# Altium schematic sheet SD.SchDoc
size A4; SheetNumber: 9; SheetTotal: 17
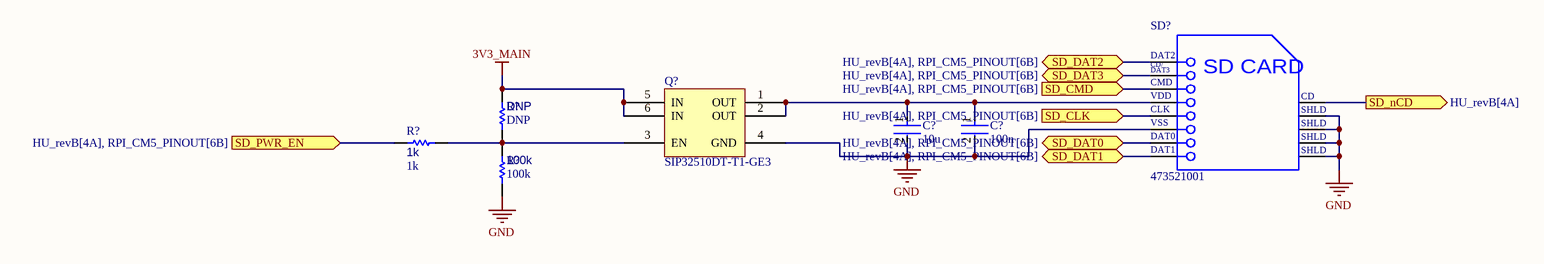
[diagram p0: SD.SchDoc]

## Parts
(Parts that share a designator on the sheet are numbered #1, #2 ... from top to bottom, then left to right.)
C?#1  10u  [FP-0402-L_1_0_0_05-W_0_5-IPC_A]
C?#2  100n  [FP-0402-L_1_0_0_05-W_0_5-IPC_A]
Q?  SIP32510DT-T1-GE3  [SOT95P284X110-6N]
R?#1  DNP  [R0603B]
R?#2  1k  [R0603B]
R?#3  100k  [R0603B]
SD?  473521001  [MOLX-473521001_V]

## Ports
SD_CLK (in, see HU_revB[4A], RPI_CM5_PINOUT[6B]), SD_CMD (in, see HU_revB[4A], RPI_CM5_PINOUT[6B]), SD_DAT0 (bidir, see HU_revB[4A], RPI_CM5_PINOUT[6B]), SD_DAT1 (bidir, see HU_revB[4A], RPI_CM5_PINOUT[6B]), SD_DAT2 (bidir, see HU_revB[4A], RPI_CM5_PINOUT[6B]), SD_DAT3 (bidir, see HU_revB[4A], RPI_CM5_PINOUT[6B]), SD_nCD (out, see HU_revB[4A]), SD_PWR_EN (in, see HU_revB[4A], RPI_CM5_PINOUT[6B])

## Nets
3V3_MAIN: Q?.5(IN) Q?.6(IN) R?#1.2
GND: C?#1.2 C?#2.2 Q?.4(GND) R?#3.1 SD?.6(VSS) SD?.10(SHLD) SD?.11(SHLD) SD?.12(SHLD) SD?.13(SHLD)
SD_CLK: SD?.5(CLK) ; port SD_CLK
SD_CMD: SD?.3(CMD) ; port SD_CMD
SD_DAT0: SD?.7(DAT0) ; port SD_DAT0
SD_DAT1: SD?.8(DAT1) ; port SD_DAT1
SD_DAT2: SD?.1(DAT2) ; port SD_DAT2
SD_DAT3: SD?.2(CD/DAT3) ; port SD_DAT3
SD_nCD: SD?.9(CD) ; port SD_nCD
SD_PWR_EN: R?#2.2 ; port SD_PWR_EN
NetC?#1_1: C?#1.1 C?#2.1 Q?.1(OUT) Q?.2(OUT) SD?.4(VDD)
NetQ?_3: Q?.3(EN) R?#1.1 R?#2.1 R?#3.2

## Notes on the sheet
- (in symbol CMP-2000-05848-1) CD/; DAT3; SD CARD

## Library data of the parts
C?#1 C?#2 = CMP-001-00058-1: LARGE PADS, 0402 CAP, CHANGE COMMENT TO MATCH REAL P/N; Capacitor Type: Ceramic; Min Operating Temperature: -55°C; Mounting Technology: Surface Mount; Pins: 2; Case/Package: 0402; RoHS Compliant: Yes; Max Operating Temperature: 85°C
Q? = CMP-019-00054-1: Power Switch ICs – Power Distribution; VISHAY; SIP32510DT-T1-GE3; 1; 1; 5.5 V; SOT-23-6; Max Supply Voltage: 5.5V; Max Power Dissipation: 833mW; Min Supply Voltage: 1.2V; Case/Package: SOT-23-6; Mounting Technology: Surface Mount; Max Operating Temperature: 85°C; Min Operating Temperature: -40°C
R?#1-R?#3 = CMP-009-00002-14: Resistor
  R?#1: Value: DNP
  R?#2: Value: 1k
  R?#3: Value: 100k
SD? = CMP-2000-05848-1: MicroSD(TM), Pitch 1.1 mm, 8 Position, Height 1.88 mm, -20 to 85 degC, RoHS, Tape and Reel; Manufacturer: Molex; Datasheet Version: Rev. G, 01/2012; Datasheet URL: http://www.molex.com/pdm_docs/sd/473521001_sd.pdf; Package Reference: 473521001; Manufacturer URL: http://www.molex.com/; Mounting Technology: SurfaceMount; Package Description: MicroSD(TM), Pitch 1.1 mm, 8 Position, Height 1.88 mm